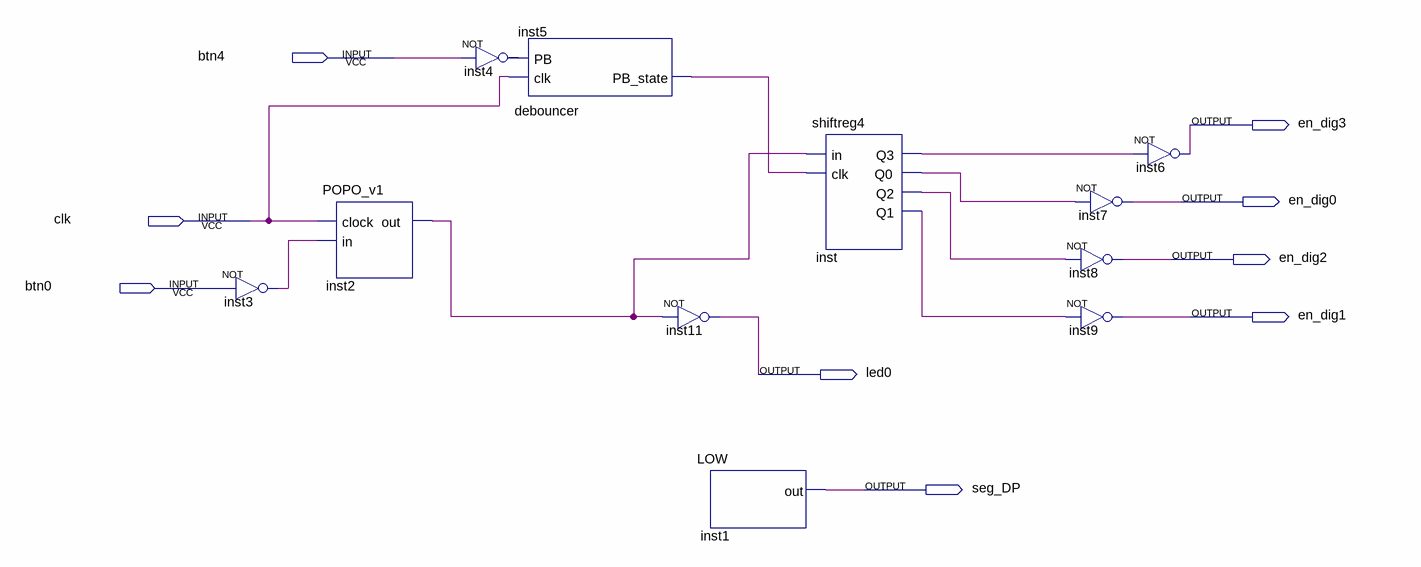
[diagram p0: schematic sheet]
// Quartus schematic test_shiftreg4_dots.bdf as structural Verilog: 11 symbols, 9 pins
module test_shiftreg4_dots (
  input  btn4,
  input  clk,
  input  btn0,
  output en_dig3,
  output en_dig0,
  output en_dig2,
  output en_dig1,
  output led0,
  output seg_DP
);

  wire inst2_out, inst3_out, inst4_out, inst5_pb_state, inst_q0, inst_q1, inst_q2, inst_q3;

  not inst3 (inst3_out, btn0);
  POPO_v1 inst2 (.clock(clk), .in(inst3_out), .out(inst2_out));
  not inst4 (inst4_out, btn4);
  debouncer inst5 (.clk(clk), .PB(inst4_out), .PB_state(inst5_pb_state));
  not inst11 (led0, inst2_out);
  LOW inst1 (.out(seg_DP));
  shiftreg4 inst (.in(inst2_out), .clk(inst5_pb_state), .Q3(inst_q3), .Q0(inst_q0), .Q2(inst_q2), .Q1(inst_q1));
  not inst7 (en_dig0, inst_q0);
  not inst8 (en_dig2, inst_q2);
  not inst9 (en_dig1, inst_q1);
  not inst6 (en_dig3, inst_q3);
endmodule
